# Altium schematic sheet Controller.SchDoc: Solar Monitoring 1.0
size A2
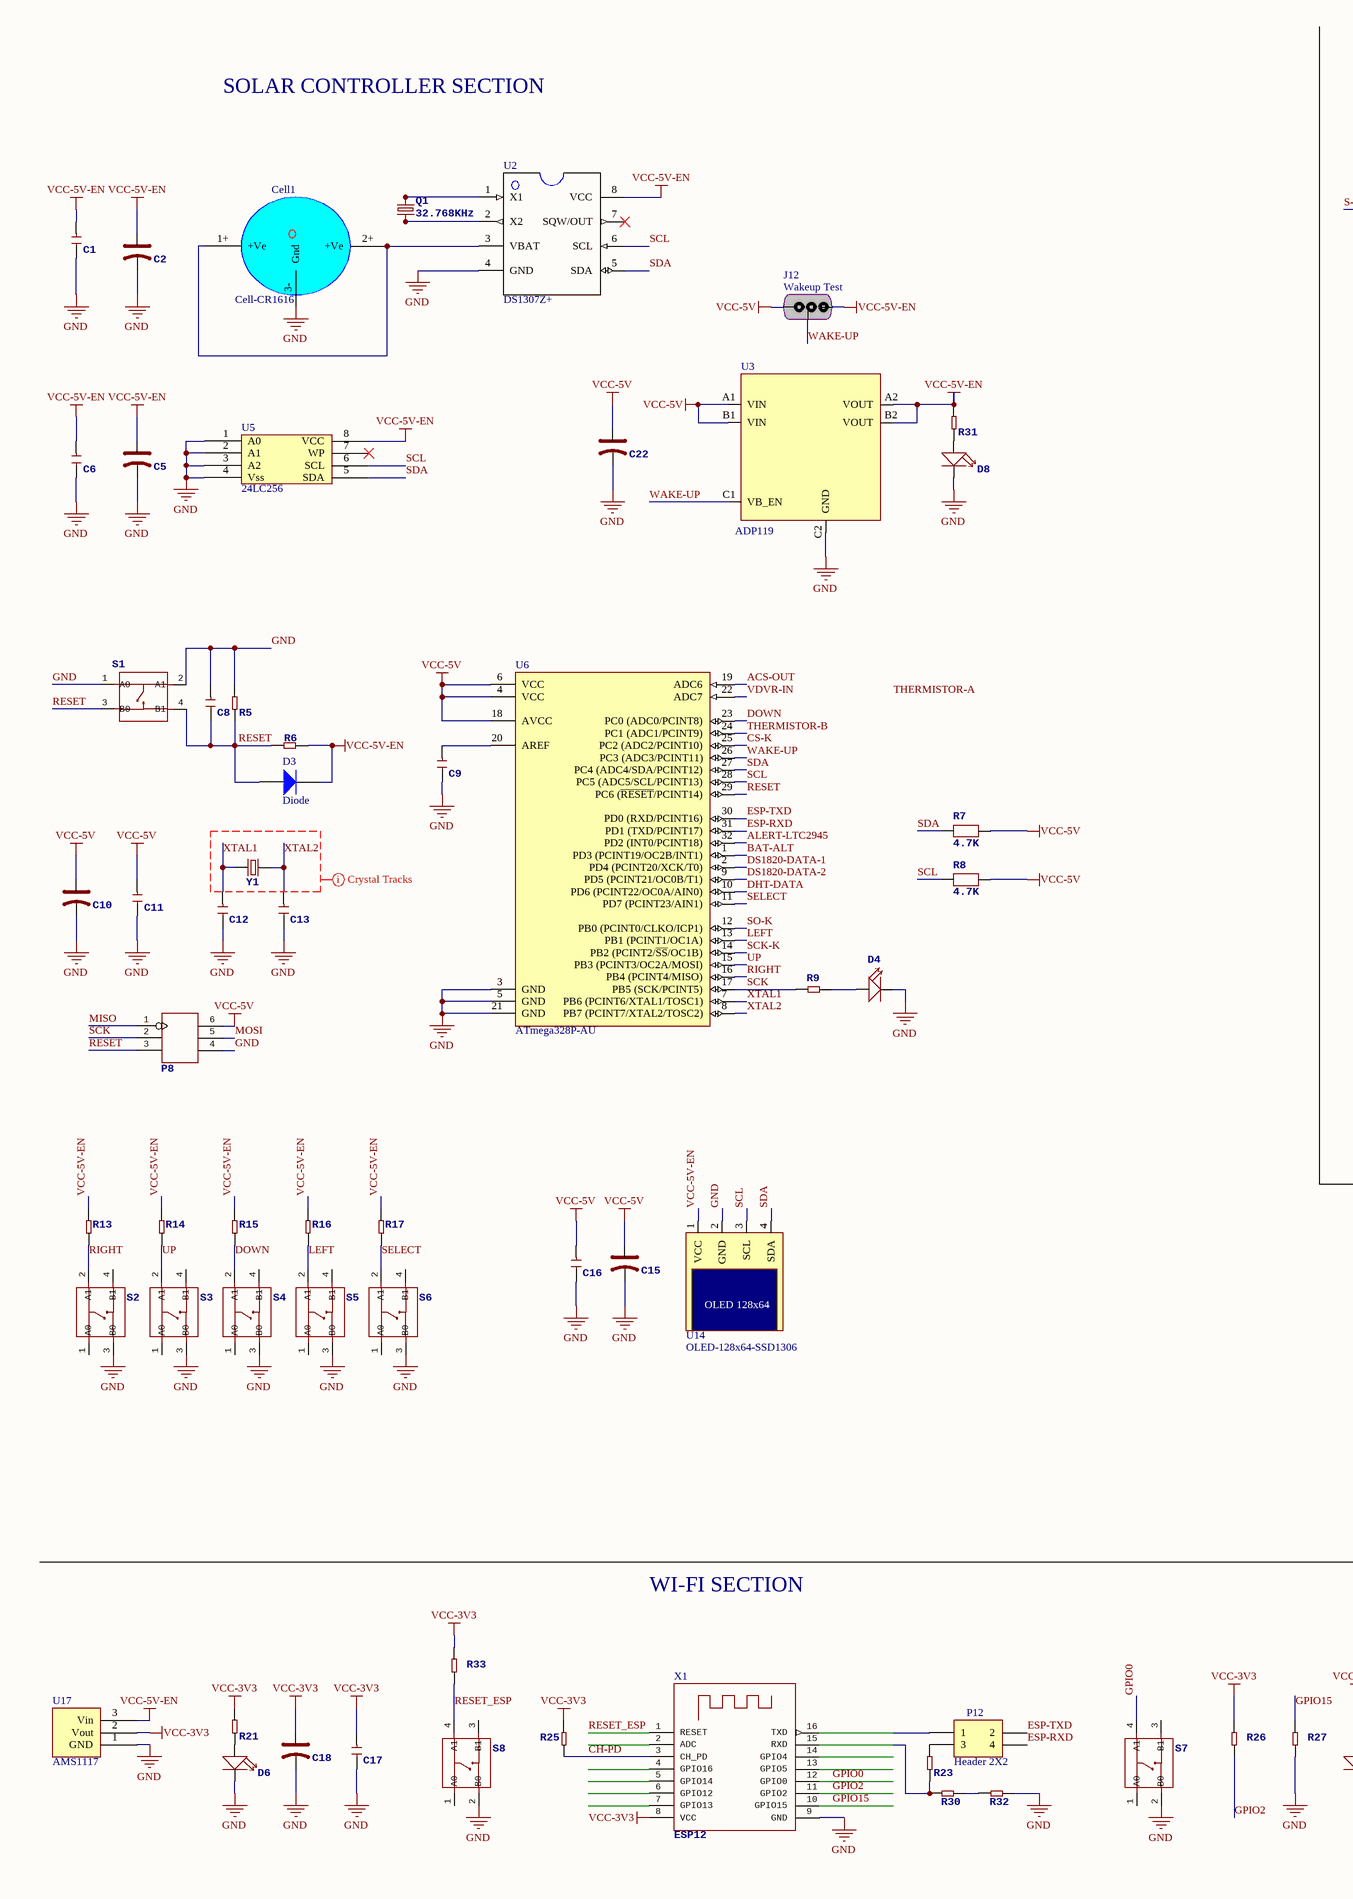
[diagram p0: Controller.SchDoc, left]
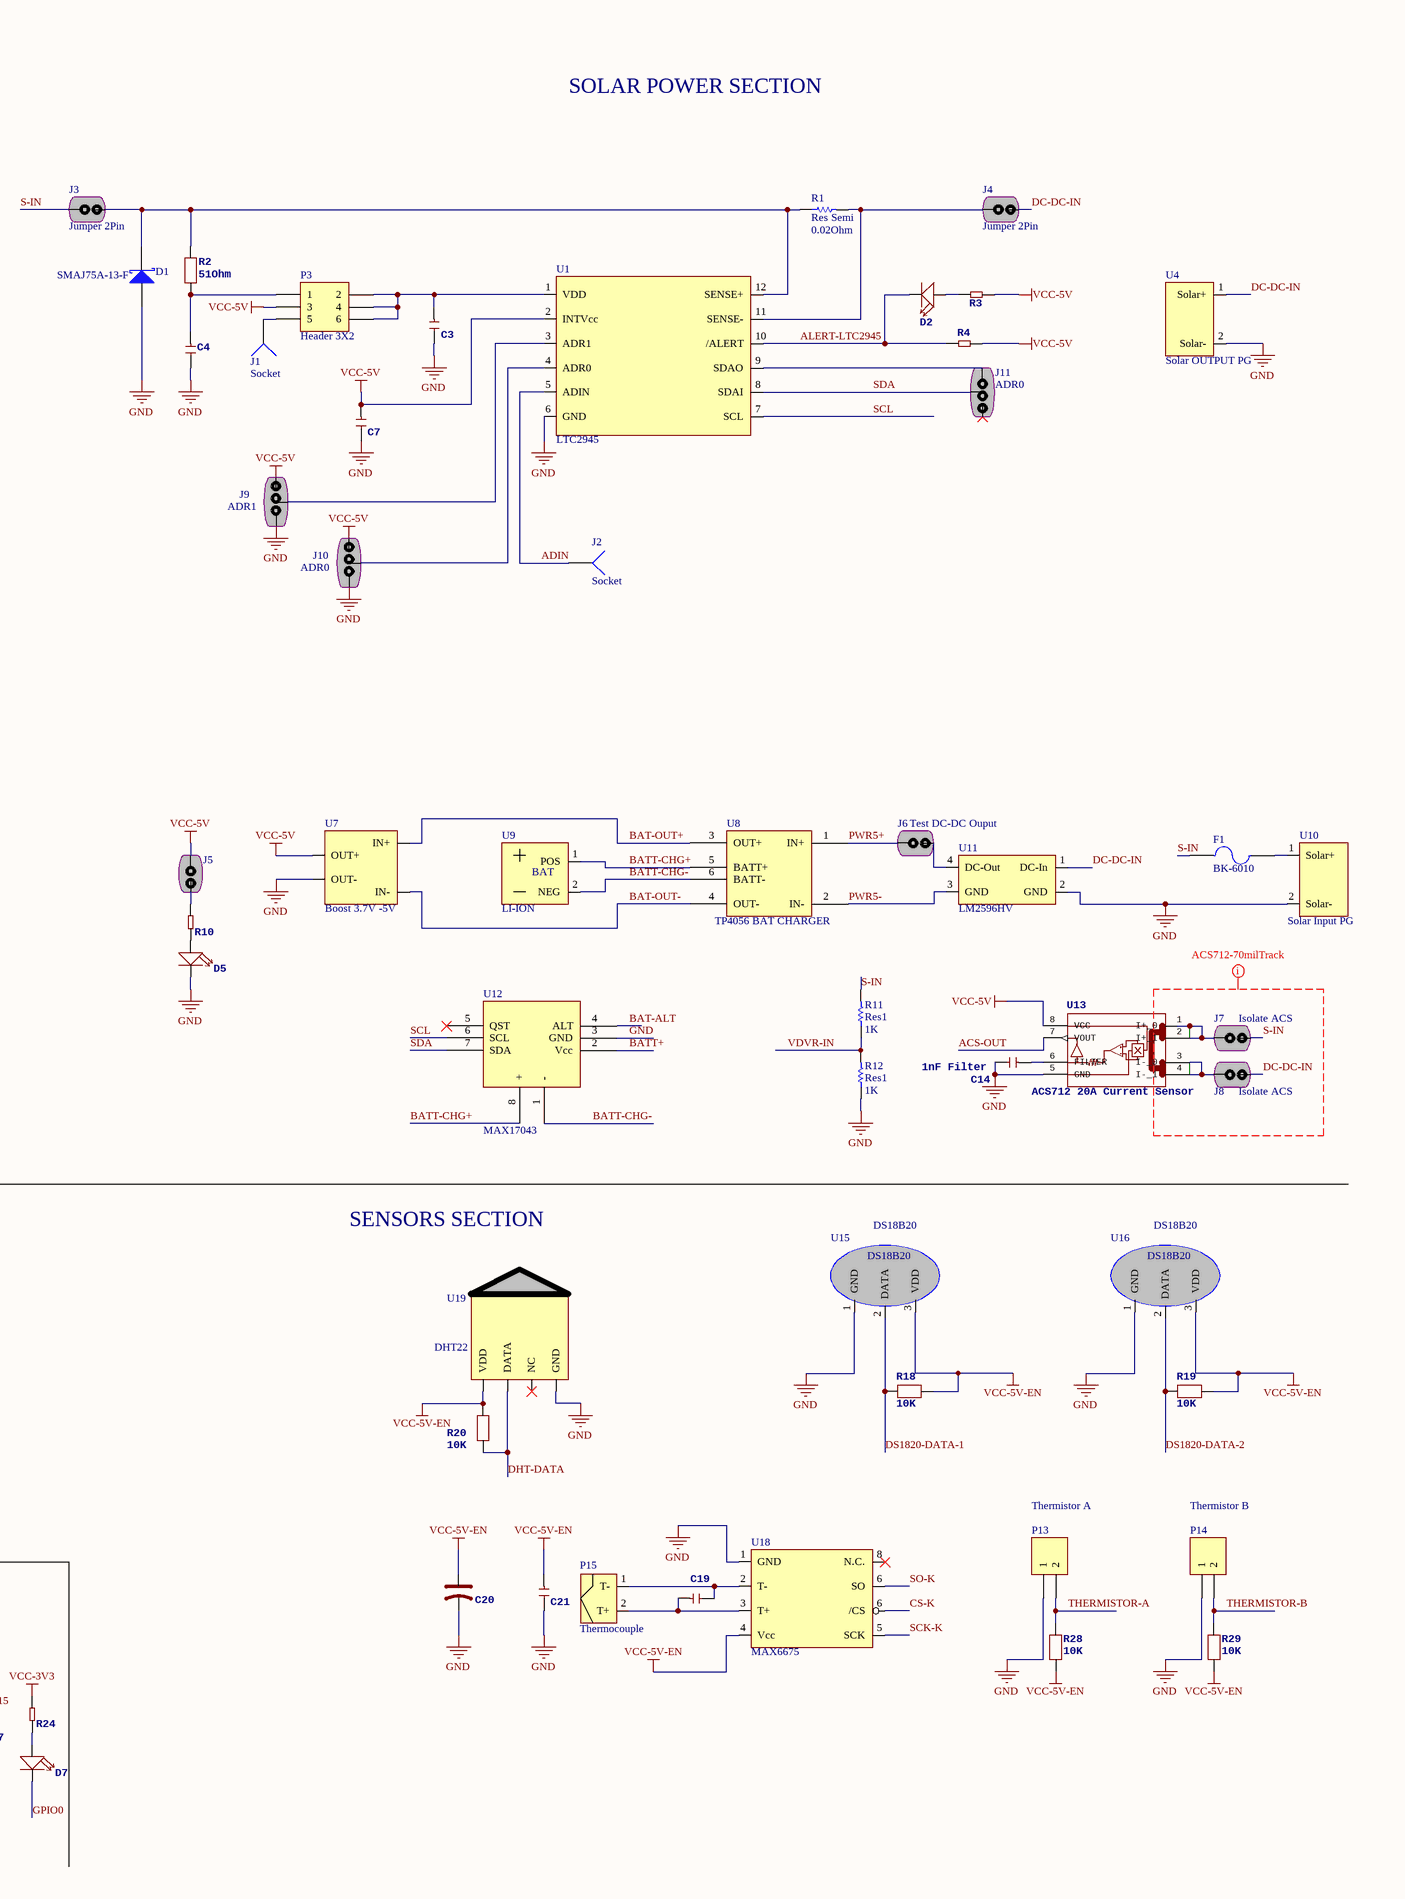
[diagram p1: Controller.SchDoc, right]

## Parts
C1  302010165  [C0805]  (value not drawn)
C2  302020002  [AVX-A]  (value not drawn)
C3  302010165  [C0805]  (value not drawn)
C4  302010189  [C1206]  (value not drawn)
C5  302020002  [AVX-A]  (value not drawn)
C6  302010165  [C0805]  (value not drawn)
C7  302010165  [C0805]  (value not drawn)
C8  302010165  [C0805]  (value not drawn)
C9  302010165  [C0805]  (value not drawn)
C10  302020002  [AVX-A]  (value not drawn)
C11  302010165  [C0805]  (value not drawn)
C12  302010018  [C0805]  (value not drawn)
C13  302010018  [C0805]  (value not drawn)
C14  1nF Filter  [C0805]
C15  302020002  [AVX-A]  (value not drawn)
C16  302010165  [C0805]  (value not drawn)
C17  302010165  [C0805]  (value not drawn)
C18  302020002  [AVX-A]  (value not drawn)
C19  302010175  [C0805]  (value not drawn)
C20  302020002  [AVX-A]  (value not drawn)
C21  302010165  [C0805]  (value not drawn)
C22  302020002  [AVX-A]  (value not drawn)
Cell1  Cell-CR1616  [CellCR1616]
D1  SMAJ75A-13-F  [SMAJ5.0-TVS]
D2  304090046  [LED-0805]  (value not drawn)
D3  Diode  [1206 Diode SMD]
D4  304090046  [LED-0805]  (value not drawn)
D5  304090046  [LED-0805]  (value not drawn)
D6  304090046  [LED-0805]  (value not drawn)
D7  304090046  [LED-0805]  (value not drawn)
D8  304090046  [LED-0805]  (value not drawn)
F1  BK-6010  [Fuse Block Blade PCB]
J1  Socket  [PIN1]
J2  Socket  [PIN1]
J3  Jumper 2Pin  [H2-2.54]
J4  Jumper 2Pin  [H2-2.54]
J5  Jumper 2Pin  [H2-2.54]  (value not drawn)
J6  Test DC-DC Ouput  [H2-2.54]
J7  Isolate ACS  [H2-2.54]
J8  Isolate ACS  [H2-2.54]
J9  ADR1  [H3-2.54]
J10  ADR0  [H3-2.54]
J11  ADR0  [H3-2.54]
J12  Wakeup Test  [H3-2.54]
P3  Header 3X2  [HDR2X3]
P8  320020077  [HDR1X6]  (value not drawn)
P12  Header 2X2  [HDR2X2]
P13  Thermistor A  [HDR1X2]
P14  Thermistor B  [HDR1X2]
P15  Thermocouple  [ScrewTerminal8.5]
Q1  32.768KHz  [RTC-XTAL]
R1  Res Semi  value 0.02Ohm  [AXIAL-0.5]
R2  51Ohm  [R0805]
R3  301010297  [R0603]  (value not drawn)
R4  301010361  [R0805]  (value not drawn)
R5  301010006  [R0402]  (value not drawn)
R6  301010361  [R0805]  (value not drawn)
R7  4.7K  [R0805]
R8  4.7K  [R0805]
R9  301010297  [R0603]  (value not drawn)
R10  301010297  [R0603]  (value not drawn)
R11  Res1  value 1K  [AXIAL-0.3]
R12  Res1  value 1K  [AXIAL-0.3]
R13  301010361  [R0805]  (value not drawn)
R14  301010361  [R0805]  (value not drawn)
R15  301010361  [R0805]  (value not drawn)
R16  301010361  [R0805]  (value not drawn)
R17  301010361  [R0805]  (value not drawn)
R18  10K  [R0805]
R19  10K  [R0805]
R20  10K  [R0805]
R21  301010297  [R0603]  (value not drawn)
R23  301010311  [R0805]  (value not drawn)
R24  301010297  [R0603]  (value not drawn)
R25  301010361  [R0805]  (value not drawn)
R26  301010361  [R0805]  (value not drawn)
R27  301010361  [R0805]  (value not drawn)
R28  10K  [R0805]
R29  10K  [R0805]
R30  301010311  [R0805]  (value not drawn)
R31  301010297  [R0603]  (value not drawn)
R32  301010311  [R0805]  (value not drawn)
R33  301010361  [R0805]  (value not drawn)
S1  311020017  [SW4-SMD-5.2X5.2X1.5MM]  (value not drawn)
S2  311020017  [SW4-SMD-5.2X5.2X1.5MM]  (value not drawn)
S3  311020017  [SW4-SMD-5.2X5.2X1.5MM]  (value not drawn)
S4  311020017  [SW4-SMD-5.2X5.2X1.5MM]  (value not drawn)
S5  311020017  [SW4-SMD-5.2X5.2X1.5MM]  (value not drawn)
S6  311020017  [SW4-SMD-5.2X5.2X1.5MM]  (value not drawn)
S7  311020004  [SW4-SMD-6.0X6.0X5.0MM]  (value not drawn)
S8  311020004  [SW4-SMD-6.0X6.0X5.0MM]  (value not drawn)
U1  LTC2945  [LTC2945]
U2  DS1307Z+  [SO08]
U3  ADP119  [BGA3x2]
U4  Solar OUTPUT PG  [SCREW TERMINAL]
U5  24LC256  [SO08]
U6  ATmega328P-AU  [TQFP32-0.8-7X7MM]
U7  Boost 3.7V -5V  [Boost Cov]
U8  TP4056 BAT CHARGER  [TP4056]
U9  LI-ION  [Cell-Holder]
U10  Solar Input PG  [SCREW TERMINAL]
U11  LM2596HV  [LM2596HVS DC-DC step-down module]
U12  MAX17043  [MAX17043]
U13  ACS712 20A Current Sensor  [SO08]
U14  OLED-128x64-SSD1306  [OLED-128x64]
U15  DS18B20  [TO-92]
U16  DS18B20  [TO-92]
U17  AMS1117  [AMS1117-3.3]
U18  MAX6675  [SO8_N]
U19  DHT22  [DHT22_AM2303_HORIZ]
X1  ESP-12  [ESP8266-12E]  (value not drawn)
Y1  306010054  [SMT_XTAL]  (value not drawn)

## Nets
GND: C1.1 C2.- C3.1 C4.1 C5.- C6.1 C7.1 C8.2 C9.1 C10.- C11.1 C12.1 C13.1 C14.1 C15.- C16.1 C17.1 C18.- C20.- C21.1 C22.- Cell1.3-(Gnd) D1.1(A) D4.- D5.- D6.- D8.- J9.1 J10.1 P8.4 P13.1 P14.1 R5.1 R12.1 R27.1 R32.1 S1.1(A0) S1.2(A1) S2.3(B0) S3.3(B0) S4.3(B0) S5.3(B0) S6.3(B0) S7.2(B0) S8.2(B0) U1.6(GND) U2.4(GND) U3.C2(GND) U4.2(Solar-) U5.1(A0) U5.2(A1) U5.3(A2) U5.4(Vss) U6.3(GND) U6.5(GND) U6.21(GND) U7.OUT- U10.2(Solar-) U11.2(GND) U12.3(GND) U13.5(GND) U14.2(GND) U15.1(GND) U16.1(GND) U17.1(GND) U18.1(GND) U19.GND X1.9(GND)
VCC-3V3: C17.2 C18.+ R21.2 R24.2 R25.2 R26.2 R33.2 U17.2(Vout) X1.8(VCC)
VCC-5V: C7.2 C10.+ C11.2 C15.+ C16.2 C22.+ J5.2 J9.3 J10.3 J12.1 P3.3 P8.6 R3.1 R4.2 R7.2 R8.2 U1.2(INTVcc) U3.A1(VIN) U3.B1(VIN) U6.4(VCC) U6.6(VCC) U6.18(AVCC) U7.OUT+ U13.8(VCC)
VCC-5V-EN: C1.2 C2.+ C5.+ C6.2 C20.+ C21.2 D3.2(K) J12.3 R6.1 R13.2 R14.2 R15.2 R16.2 R17.2 R18.1 R19.1 R20.2 R28.1 R29.1 R31.2 U2.8(VCC) U3.A2(VOUT) U3.B2(VOUT) U5.8(VCC) U14.1(VCC) U15.3(VDD) U16.3(VDD) U17.3(Vin) U18.4(Vcc) U19.VDD
ACS-OUT: U6.19(ADC6) U13.7(VOUT)
ADIN: J2.1 U1.5(ADIN)
ALERT-LTC2945: D2.- R4.1 U1.10(/ALERT) U6.32(PD2_(INT0/PCINT18))
BAT-ALT: U6.1(PD3_(PCINT19/OC2B/INT1)) U12.4(ALT)
BAT-OUT+: U7.IN+ U8.3(OUT+)
BAT-OUT-: U7.IN- U8.4(OUT-)
BATT+: U12.2(Vcc)
BATT-CHG+: U8.5(BATT+) U9.1(POS) U12.8(+)
BATT-CHG-: U8.6(BATT-) U9.2(NEG) U12.1(-)
CH-PD: R25.1 X1.3(CH_PD)
CS-K: U6.25(PC2_(ADC2/PCINT10)) U18.6(/CS)
DC-DC-IN: J4.1 J8.1 U4.1(Solar+) U11.1(DC-In)
DHT-DATA: R20.1 U6.10(PD6_(PCINT22/OC0A/AIN0)) U19.DATA
DOWN: R15.1 S4.2(A1) U6.23(PC0_(ADC0/PCINT8))
DS1820-DATA-1: R18.2 U6.2(PD4_(PCINT20/XCK/T0)) U15.2(DATA)
DS1820-DATA-2: R19.2 U6.9(PD5_(PCINT21/OC0B/T1)) U16.2(DATA)
ESP-RXD: P12.4 U6.31(PD1_(TXD/PCINT17))
ESP-TXD: P12.2 U6.30(PD0_(RXD/PCINT16))
GPIO0: D7.- S7.4(A1) X1.12(GPIO0)
GPIO2: R26.1 X1.11(GPIO2)
GPIO15: R27.2 X1.10(GPIO15)
LEFT: R16.1 S5.2(A1) U6.13(PB1_(PCINT1/OC1A))
MISO: P8.1
MOSI: P8.5
PWR5+: J6.2 U8.1(IN+)
PWR5-: U8.2(IN-) U11.3(GND)
RESET: C8.1 D3.1(A) P8.3 R5.2 R6.2 S1.3(B0) S1.4(B1) U6.29(PC6_(~{RESET}/PCINT14))
RESET_ESP: R33.1 S8.4(A1) X1.1(RESET)
RIGHT: R13.1 S2.2(A1) U6.16(PB4_(PCINT4/MISO))
S-IN: F1.1 J3.2 J7.1 R11.2
SCK: P8.2 R9.1 U6.17(PB5_(SCK/PCINT5))
SCK-K: U6.14(PB2_(PCINT2/~{SS}/OC1B)) U18.5(SCK)
SCL: R8.1 U1.7(SCL) U2.6(SCL) U5.6(SCL) U6.28(PC5_(ADC5/SCL/PCINT13)) U12.6(SCL) U14.3(SCL)
SDA: J11.2 R7.1 U1.8(SDAI) U2.5(SDA) U5.5(SDA) U6.27(PC4_(ADC4/SDA/PCINT12)) U12.7(SDA) U14.4(SDA)
SELECT: R17.1 S6.2(A1) U6.11(PD7_(PCINT23/AIN1))
SO-K: U6.12(PB0_(PCINT0/CLKO/ICP1)) U18.6(SO)
THERMISTOR-A: P13.2 R28.2
THERMISTOR-B: P14.2 R29.2 U6.24(PC1_(ADC1/PCINT9))
UP: R14.1 S3.2(A1) U6.15(PB3_(PCINT3/OC2A/MOSI))
VDVR-IN: R11.1 R12.2 U6.22(ADC7)
WAKE-UP: J12.2 U3.C1(VB_EN) U6.26(PC3_(ADC3/PCINT11))
XTAL1: C12.2 U6.7(PB6_(PCINT6/XTAL1/TOSC1)) Y1.1
XTAL2: C13.2 U6.8(PB7_(PCINT7/XTAL2/TOSC2)) Y1.2
NetC3_2: C3.2 P3.2 P3.4 P3.6 U1.1(VDD)
NetC4_2: C4.2 P3.1 R2.2
NetC9_2: C9.2 U6.20(AREF)
NetC14_2: C14.2 U13.6(FILTER)
NetC19_1: C19.1 P15.1(T-) U18.2(T-)
NetC19_2: C19.2 P15.2(T+) U18.3(T+)
NetCell1_1+: Cell1.1+(+Ve) Cell1.2+(+Ve) U2.3(VBAT)
NetD1_2: D1.2(K) J3.1 R1.1 R2.1 U1.12(SENSE+)
NetD2_+: D2.+ R3.2
NetD4_+: D4.+ R9.2
NetD5_+: D5.+ R10.1
NetD6_+: D6.+ R21.1
NetD7_+: D7.+ R24.1
NetD8_+: D8.+ R31.1
NetF1_2: F1.2 U10.1(Solar+)
NetJ1_1: J1.1 P3.5
NetJ4_2: J4.2 R1.2 U1.11(SENSE-)
NetJ5_1: J5.1 R10.2
NetJ6_1: J6.1 U11.4(DC-Out)
NetJ7_2: J7.2 U13.1(I+_0) U13.2(I+_1)
NetJ8_2: J8.2 U13.3(I-_0) U13.4(I-_1)
NetJ9_2: J9.2 U1.3(ADR1)
NetJ10_2: J10.2 U1.4(ADR0)
NetJ11_1: J11.1 U1.9(SDAO)
NetP12_1: P12.1 X1.16(TXD)
NetP12_3: P12.3 R23.2
NetQ1_1: Q1.1 U2.1(X1)
NetQ1_2: Q1.2 U2.2(X2)
NetR23_1: R23.1 R30.2 X1.15(RXD)
NetR30_1: R30.1 R32.2

Not connected (* = marked no-connect by the designer): J11 3*; S2 1(A0) 4(B1); S3 1(A0) 4(B1); S4 1(A0) 4(B1); S5 1(A0) 4(B1); S6 1(A0) 4(B1); S7 1(A0) 3(B1); S8 1(A0) 3(B1); U2 7(SQW/OUT)*; U5 7(WP)*; U12 5(QST)*; U18 8(N.C.)*; U19 NC*; X1 2(ADC) 4(GPIO16) 5(GPIO14) 6(GPIO12) 7(GPIO13) 13(GPIO5) 14(GPIO4)

## Layout directives
rule Routing Layers [TopLayer - Enabled BottomLayer - Disabled]: XTAL1, XTAL2
ACS712-70milTrackIN: ACS712-70milTrack; rule Width Constraint [Pref Width = 70mil    Min Width = 70mil    Max Width = 70mil]: DC-DC-IN, S-IN

## Notes on the sheet
- SOLAR CONTROLLER SECTION
- SOLAR POWER SECTION
- SENSORS SECTION
- WI-FI SECTION
- Labels drawn without touching a wire or pin: THERMISTOR-A
- (in symbol Battery) BAT
- (in symbol OLED-128x64-SSD1306) OLED 128x64

## Library data of the parts
C1 C3 C6-C9 C11 C16 C17 C21 = CERAMIC-100NF-50V-10%-X7R(0805): 100nF; MPN: CC0805KRX7R9BB104
C2 C5 C10 C15 C18 C20 C22 = TANTALUM-SMD-10UF-16V-10%(AVX-A): 10uF Cap Decoupling 16V; MPN: TAJA106K016RNJ
C4 = CERAMIC-1NF-1KV-10%-X7R?(1206): MPN: CC1206KKX7RCBB102
C12 C13 = CERAMIC-22PF-50V-5%-NPO(0402): MPN: CC0402JRNPO9BN220
C14 = CERAMIC-100NF-25V-10%-X7R(0402): 1nF Filter Cap as per Datasheet; MPN: CC0402KRX7R8BB104
C19 = CERAMIC-10NF-50V-5%-X7R(0805): MPN: CC0805JRX7R9BB103
D1 = D Schottky: SMA; Published: 8-Jun-2000; LatestRevisionDate: 17-Jul-2002; LatestRevisionNote: Re-released for DXP Platform.; PackageReference: SMB; Publisher: Altium Limited; PackageDescription: DO-214-AA/SMB; 2 C-Bend Leads; Body 5.3 x 3.6 mm, inc. leads (LxW); Code_JEDEC: DO-214-AA
D2 D4-D8 = SMD-LED-CLEAR-RED(0805): MPN: 17-215SURC/S530-A2/TR8
D3 = Diode: Default Diode; Published: 8-Jun-2000; LatestRevisionDate: 17-Jul-2002; LatestRevisionNote: Re-released for DXP Platform.; PackageVersion: Sep-1996; PackageReference: SMC; Publisher: Altium Limited; PackageDescription: DO-214-AB/SMC; 2 C-Bend Leads; Body 7.9 x 5.9 mm, inc. leads (LxW); Code_JEDEC: DO-214-AB
F1 = Fuse 2: BK-6010, BK-6010-ND,; Published: 8-Jun-2000; LatestRevisionDate: 17-Jul-2002; LatestRevisionNote: Re-released for DXP Platform.; PackageReference: PIN-W2/E2.8; Publisher: Altium Limited; PackageDescription: Thru-Hole; 2 Leads
J3-J8 = Jumper: 2.54, Pin header
J9-J12 = Jumper Select: 2.54mm Pitch male header
P3 = Header 3X2: Header, 3-Pin, Dual row; LatestRevisionDate: 17-Jul-2002; LatestRevisionNote: Re-released for DXP Platform.; Publisher: Altium Limited
P8 = DIP-BLACK-MALE-HEADER(2X3P-2.54）-2.54: MPN: P125-12A1BS116A1
P12 = Header 2X2: Header, 2-Pin, Dual row; LatestRevisionDate: 17-Jul-2002; LatestRevisionNote: Re-released for DXP Platform.; Publisher: Altium Limited
P13 P14 = Header 2: Header, 2-Pin; LatestRevisionDate: 17-Jul-2002; LatestRevisionNote: Re-released for DXP Platform.; Publisher: Altium Limited
P15 = ScrewTerminal8.5: K Type Termocouple
Q1 = CRYTALTC38H
R1 = Res Semi: Semiconductor Resistor; Published: 8-Jun-2000; LatestRevisionDate: 17-Jul-2002; LatestRevisionNote: Re-released for DXP Platform.; PackageReference: AXIAL-0.5; Publisher: Altium Limited; PackageDescription: Axial Device, Thru-Hole; 2 Leads; 0.5 in Pin Spacing
R2 R7 R8 R18-R20 R28 R29 = RESISTOR0805_NOOUTLINE: Resistors   For new designs, use the packages preceded by an '_' character since they are more reliable:   The following footprints should be used on most boards: _0402 - Standard footprint for regular board layouts  _0603 - Standard footprint for regular board layouts  _0805 - Standard footprint for regular board layouts  _1206 - Standard footprint for regular board layouts       For extremely tight-pitch boards where space is at a premium, the following 'micro-pitch' footprints can be used (smaller pads, no silkscreen outline, etc.): _0402MP - Micro-pitch footprint for very dense/compact boards  _0603MP - Micro-pitch footprint for very dense/compact boards  _0805MP - Micro-pitch footprint for very dense/compact boards  _1206MP - Micro-pitch footprint for very dense/compact boards
R3 R9 R10 R21 R24 R31 = SMD-RES-390R-5%-1/10W(0603): MPN: RC0603JR-07390RL
R4 = SMD-RES-10K-1%-1/8W(0805): 10K; MPN: RC0805FR-0710KL
R5 = SMD-RES-1K-5%-1/16W(0402): MPN: RC0402JR-071KL
R6 = SMD-RES-10K-1%-1/8W(0805): Pull up 10K resistor; MPN: RC0805FR-0710KL
R11 R12 = Res1: Resistor; Published: 8-Jun-2000; LatestRevisionDate: 17-Jul-2002; LatestRevisionNote: Re-released for DXP Platform.; PackageReference: AXIAL-0.3; Publisher: Altium Limited; PackageDescription: Axial Device, Thru-Hole; 2 Leads; 0.3 in Pin Spacing
R13-R17 R25-R27 R33 = SMD-RES-10K-1%-1/8W(0805): Pull up 10K resistor for button; MPN: RC0805FR-0710KL
R23 R30 R32 = SMD-RES-1K-5%-1/8W(0805): MPN: RC0805JR-071KL
S1-S6 = SMD-BUTTON(4P-5.2X5.2X1.5MM-SKQGADE010)-SKQGADE010: MPN: SKQGADE010
S7 S8 = SMD-SWITCH-TACTILE-SPST-NO(4P-D6.0MM): MPN: DTSM-62K-S-V-T/R(SN431)
U1 = LTC2945: V I P Monitor I2C Interface
U2 = DS1307Z+: RTC circuit%3B I2C%3B NV SRAM%3B 56B%3B 4.5%C3%B75.5VDC%3B SO8; MF: Maxim Integrated; Availability: Good; MP: DS1307Z+; Price: 2.54 USD; Package: SOIC-8 Maxim Integrated; Value: *
U4 U10 = PG_IN
U6 = ATmega328P-AU: 8-bit AVR Microcontroller, 32KB Flash, 1KB EEPROM, 2KB SRAM, 32-pin TQFP, Industrial Grade (-40°C to 85°C); Published: 1-Apr-2010; DatasheetVersion: revA, Jan-2010; PackageVersion: revB, Oct-2001; PackageReference: 32A; Publisher: Altium Limited; PackageDescription: 32-Lead, 7x7x1.0 mm Body, 0.8mm Lead Pitch, Thin Profile Plastic Quad Flat Package (TQFP); Supplier 1: Digi-Key; Supplier Part Number 1: ATMEGA328P-AU-ND; Supplier 2: Farnell; Supplier Part Number 2: 1715486; Supplier 3: Mouser; Supplier Part Number 3: 556-ATMEGA328P-AU; Code_JEDEC: MS-026-ABA; ComponentLink1Description: Manufacturer Link; ComponentLink1URL: http://www.atmel.com/products/avr/default.asp?; ComponentLink2Description: ATmega48A/48PA/88A/88PA/168A/168PA/328/328P Datasheet; ComponentLink2URL: http://www.atmel.com/dyn/resources/prod_documents/8271.pdf; ComponentLink3Description: ATmega48A/48PA/88A/88PA/168A/168PA/328/328P Summary; ComponentLink3URL: http://www.atmel.com/dyn/resources/prod_documents/8271S.pdf; ComponentLink4Description: Atmel.com Home; ComponentLink4URL: http://www.atmel.com
U7 = Boost-3.7V-5V: Boost converter module from Cell to 5V
U8 = TP4056: TP4056 Module
U9 = Battery: Li Ion Battery 3.7V
U11 = LM2596HV: DC DC Adjustable Buck converter input upto 60V
U12 = MAX17043: Battery Fuel Guage
U13 = ACS712
U14 = OLED-128x64-SSD1306: OLED Display OLED-128x64-SSD1306
U15 U16 = DS18B20: On Board Temperature Sensor
U17 = AMS1117: 3.3V Regulator
U18 = MAX6675: K-Thermocoupleto-Digital  Converter
U19 = DHT22: Temperature and Humidity Sensor
Y1 = SMD-CRYSTAL-16MHZ-8PF-20PPM-40R(2P-5.0X3.2MM): MPN: X053201602002
J1 J2 = Socket: LatestRevisionDate: 17-Jul-2002; LatestRevisionNote: Re-released for DXP Platform.; Publisher: Altium Limited
X1 = ESP-12: ESP12: ESP12